# Altium project Hrafn.PrjPcb (part 1 of 3)
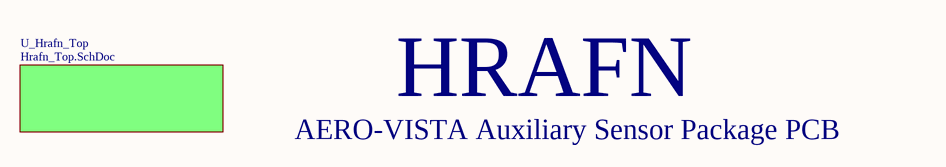
[diagram p0: Title.SchDoc]
Date: 6/18/2021; Drawn: Nicholas Belsten; ProgramName: AERO-VISTA; ProjectTitle: Hrafn; Revision: 1.4
10 sheets, 391 parts. Net scope: hierarchical (ports join the sheet entries above them; power ports are global).
Board file: Hrafn.PcbDoc
Sheets:
  Title.SchDoc
    U_Hrafn_Top = Hrafn_Top.SchDoc
      U_CAN_Bus = CAN_Bus.SchDoc
      U_Magnetometers = Magnetometers.SchDoc
        MF8 = Magnetometer_Filter.SchDoc
        MF7 = Magnetometer_Filter.SchDoc
        MF6 = Magnetometer_Filter.SchDoc
        MF5 = Magnetometer_Filter.SchDoc
        MF4 = Magnetometer_Filter.SchDoc
        MF3 = Magnetometer_Filter.SchDoc
        MF2 = Magnetometer_Filter.SchDoc
        MF1 = Magnetometer_Filter.SchDoc
        MC1 = Magnetometer_Channel.SchDoc
        MC2 = Magnetometer_Channel.SchDoc
      U_Power_HK = Power_HK.SchDoc
        LCF = LC_Filter.SchDoc
      U_Clock = Clock.SchDoc
      U_Ethernet = Ethernet.SchDoc

## Sheet Title.SchDoc: Hrafn
size Tabloid; Author: Nicholas Belsten; DrawnBy: Nicholas Belsten; Revision: 1.4; SheetNumber: 1; SheetTotal: 10; DCN: Aika; ProgramName: AERO-VISTA; Section: Title

### Sub-sheets
U_Hrafn_Top = Hrafn_Top.SchDoc: no entries

### Notes on the sheet
- HRAFN
- AERO-VISTA Auxiliary Sensor Package PCB
- Title
- Size
- Date
- Tabloid
- Section
- Time
- Sheet
- of
- Revision
- Drawn
- 33-207 / 77 Mass. Ave.
- Cambridge, MA 02139
- File

## Sheet Hrafn_Top.SchDoc: Hrafn
size Tabloid; DrawnBy: Nicholas Belsten; Organization: MIT; Address1: Route 40; Address2: Westford MA 01886; Address3: USA; DocumentNumber: 1; Revision: 1.4; SheetNumber: 2; SheetTotal: 10; DCN: Aika; ProgramName: AERO-VISTA; Section: Top
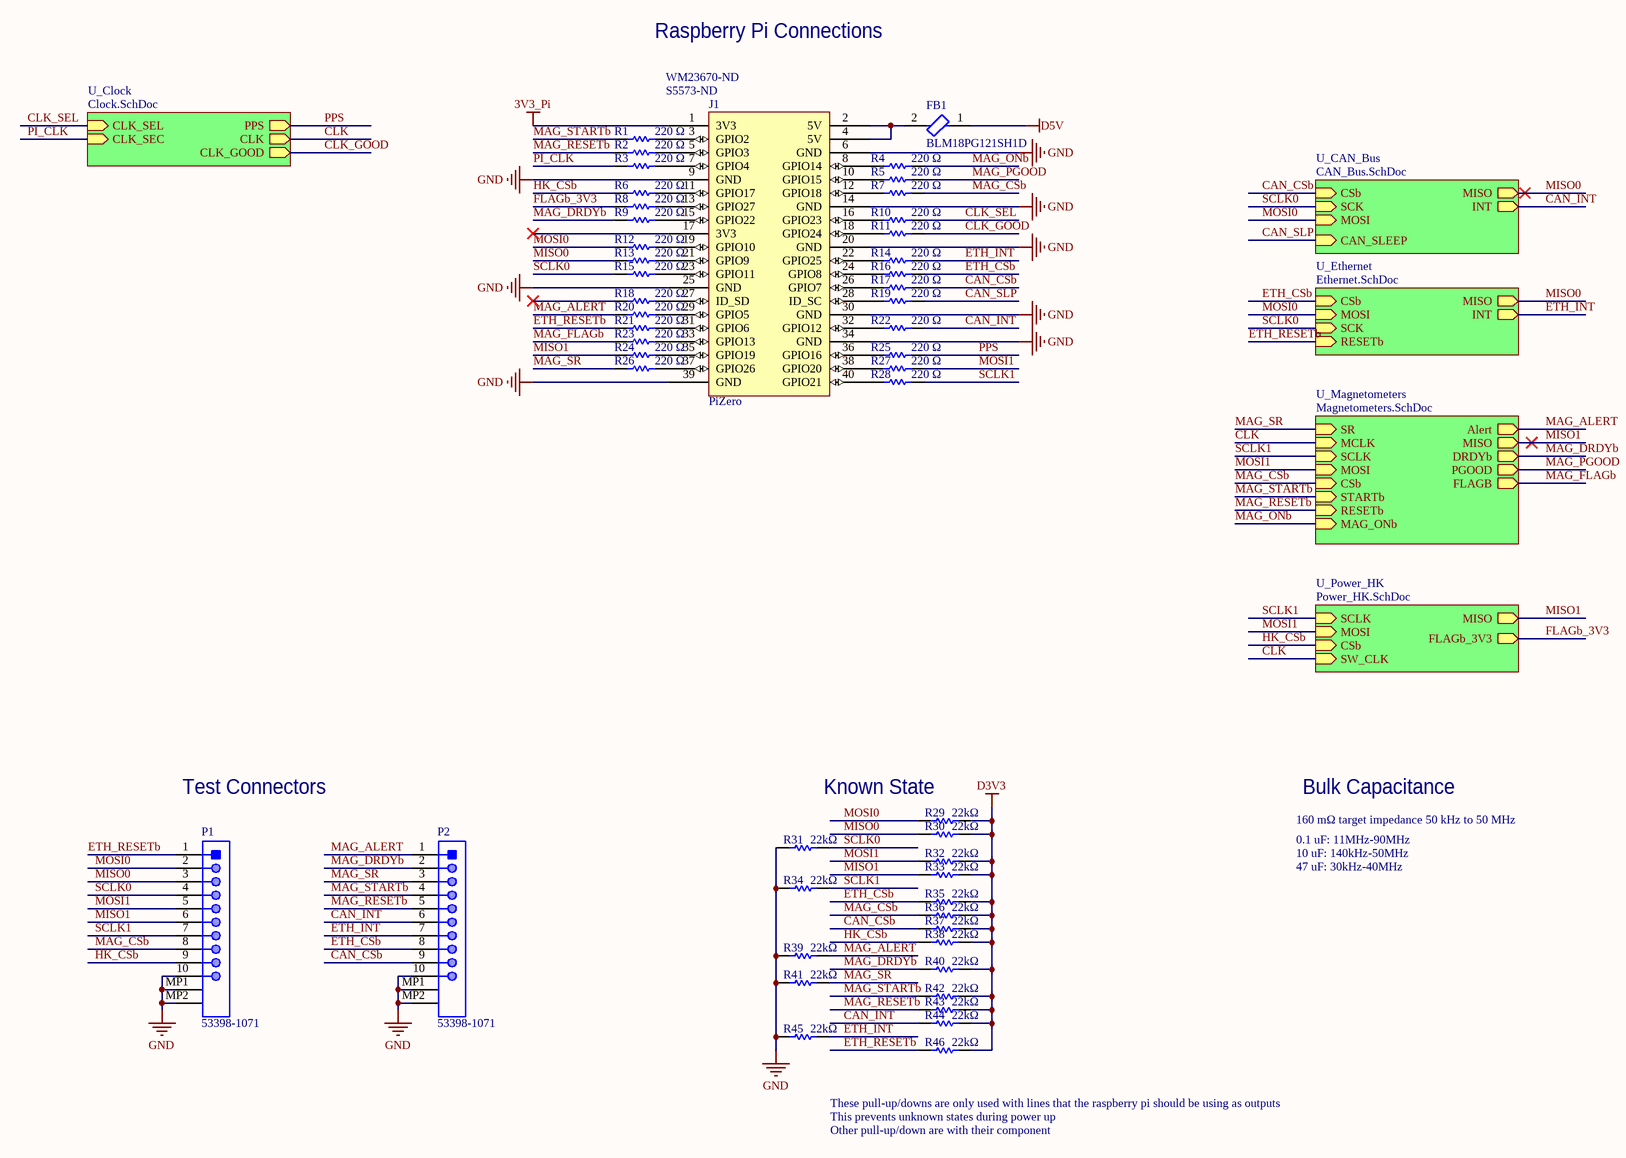
[diagram p1: Hrafn_Top.SchDoc]

### Parts
FB1  BLM18PG121SH1D  [FP-BLM18-0_15-t0_8-IPC_C]
J1  PiZero  Supplier Part Number 1: S5573-ND  Supplier Part Number 2: WM23670-ND  [DIP40]
P1  53398-1071  [MOLX-53398-1071_V]
P2  53398-1071  [MOLX-53398-1071_V]
R1  220 Ω  [RESC1005X40X25LL05T05]
R2  220 Ω  [RESC1005X40X25LL05T05]
R3  220 Ω  [RESC1005X40X25LL05T05]
R4  220 Ω  [RESC1005X40X25LL05T05]
R5  220 Ω  [RESC1005X40X25LL05T05]
R6  220 Ω  [RESC1005X40X25LL05T05]
R7  220 Ω  [RESC1005X40X25LL05T05]
R8  220 Ω  [RESC1005X40X25LL05T05]
R9  220 Ω  [RESC1005X40X25LL05T05]
R10  220 Ω  [RESC1005X40X25LL05T05]
R11  220 Ω  [RESC1005X40X25LL05T05]
R12  220 Ω  [RESC1005X40X25LL05T05]
R13  220 Ω  [RESC1005X40X25LL05T05]
R14  220 Ω  [RESC1005X40X25LL05T05]
R15  220 Ω  [RESC1005X40X25LL05T05]
R16  220 Ω  [RESC1005X40X25LL05T05]
R17  220 Ω  [RESC1005X40X25LL05T05]
R18  220 Ω  [RESC1005X40X25LL05T05]
R19  220 Ω  [RESC1005X40X25LL05T05]
R20  220 Ω  [RESC1005X40X25LL05T05]
R21  220 Ω  [RESC1005X40X25LL05T05]
R22  220 Ω  [RESC1005X40X25LL05T05]
R23  220 Ω  [RESC1005X40X25LL05T05]
R24  220 Ω  [RESC1005X40X25LL05T05]
R25  220 Ω  [RESC1005X40X25LL05T05]
R26  220 Ω  [RESC1005X40X25LL05T05]
R27  220 Ω  [RESC1005X40X25LL05T05]
R28  220 Ω  [RESC1005X40X25LL05T05]
R29  22kΩ  [RESC1005X40X25LL05T05]
R30  22kΩ  [RESC1005X40X25LL05T05]
R31  22kΩ  [RESC1005X40X25LL05T05]
R32  22kΩ  [RESC1005X40X25LL05T05]
R33  22kΩ  [RESC1005X40X25LL05T05]
R34  22kΩ  [RESC1005X40X25LL05T05]
R35  22kΩ  [RESC1005X40X25LL05T05]
R36  22kΩ  [RESC1005X40X25LL05T05]
R37  22kΩ  [RESC1005X40X25LL05T05]
R38  22kΩ  [RESC1005X40X25LL05T05]
R39  22kΩ  [RESC1005X40X25LL05T05]
R40  22kΩ  [RESC1005X40X25LL05T05]
R41  22kΩ  [RESC1005X40X25LL05T05]
R42  22kΩ  [RESC1005X40X25LL05T05]
R43  22kΩ  [RESC1005X40X25LL05T05]
R44  22kΩ  [RESC1005X40X25LL05T05]
R45  22kΩ  [RESC1005X40X25LL05T05]
R46  22kΩ  [RESC1005X40X25LL05T05]

### Sub-sheets
U_CAN_Bus = CAN_Bus.SchDoc: CSb (in), SCK (in), MOSI (in), MISO (out), INT (out), CAN_SLEEP (in)
U_Clock = Clock.SchDoc: PPS (out), CLK_SEL (in), CLK (out), CLK_SEC (in), CLK_GOOD (out)
U_Ethernet = Ethernet.SchDoc: CSb (in), MOSI (in), MISO (out), SCK (in), INT (out), RESETb (in)
U_Magnetometers = Magnetometers.SchDoc: SR (in), MCLK (in), Alert (out), SCLK (in), MOSI (in), MISO (out), CSb (in), DRDYb (out), STARTb (in), RESETb (in), MAG_ONb (in), PGOOD (out), FLAGB (out)
U_Power_HK = Power_HK.SchDoc: SCLK (in), MOSI (in), MISO (out), CSb (in), SW_CLK (in), FLAGb_3V3 (out)

### Nets
3V3_Pi: J1.1(3V3)
D3V3: R29.2 R30.2 R32.2 R33.2 R35.2 R36.2 R37.2 R38.2 R40.2 R42.2 R43.2 R44.2 R46.2
D5V: FB1.1
GND: J1.6(GND) J1.9(GND) J1.14(GND) J1.20(GND) J1.25(GND) J1.30(GND) J1.34(GND) J1.39(GND) P1.10 P1.MP1 P1.MP2 P2.10 P2.MP1 P2.MP2 R31.1 R34.1 R39.1 R41.1 R45.1  [project net DGND]
CAN_CSb: P2.9 R17.2 R37.1 ; sheet U_CAN_Bus/CSb
CAN_INT: P2.6 R22.2 R44.1 ; sheet U_CAN_Bus/INT
CAN_SLP: R19.2 ; sheet U_CAN_Bus/CAN_SLEEP
CLK: sheet U_Magnetometers/MCLK, sheet U_Power_HK/SW_CLK, sheet U_Clock/CLK
CLK_GOOD: R11.2 ; sheet U_Clock/CLK_GOOD
CLK_SEL: R10.2 ; sheet U_Clock/CLK_SEL
ETH_CSb: P2.8 R16.2 R35.1 ; sheet U_Ethernet/CSb
ETH_INT: P2.7 R14.2 R45.2 ; sheet U_Ethernet/INT
ETH_RESETb: P1.1 R21.1 R46.1 ; sheet U_Ethernet/RESETb
FLAGb_3V3: R8.1 ; sheet U_Power_HK/FLAGb_3V3
HK_CSb: P1.9 R6.1 R38.1 ; sheet U_Power_HK/CSb
MAG_ALERT: P2.1 R20.1 R39.2 ; sheet U_Magnetometers/Alert
MAG_CSb: P1.8 R7.2 R36.1 ; sheet U_Magnetometers/CSb
MAG_DRDYb: P2.2 R9.1 R40.1 ; sheet U_Magnetometers/DRDYb
MAG_FLAGb: R23.1 ; sheet U_Magnetometers/FLAGB  [project net FLAGB_MAG]
MAG_ONb: R4.2 ; sheet U_Magnetometers/MAG_ONb
MAG_PGOOD: R5.2 ; sheet U_Magnetometers/PGOOD
MAG_RESETb: P2.5 R2.1 R43.1 ; sheet U_Magnetometers/RESETb
MAG_SR: P2.3 R26.1 R41.2 ; sheet U_Magnetometers/SR
MAG_STARTb: P2.4 R1.1 R42.1 ; sheet U_Magnetometers/STARTb
MISO0: P1.3 R13.1 R30.1 ; sheet U_CAN_Bus/MISO, sheet U_Ethernet/MISO
MISO1: P1.6 R24.1 R33.1 ; sheet U_Magnetometers/MISO, sheet U_Power_HK/MISO
MOSI0: P1.2 R12.1 R29.1 ; sheet U_CAN_Bus/MOSI, sheet U_Ethernet/MOSI
MOSI1: P1.5 R27.2 R32.1 ; sheet U_Magnetometers/MOSI, sheet U_Power_HK/MOSI
PI_CLK: R3.1 ; sheet U_Clock/CLK_SEC  [project net CLK_SEC]
PPS: R25.2 ; sheet U_Clock/PPS
SCLK0: P1.4 R15.1 R31.2 ; sheet U_CAN_Bus/SCK, sheet U_Ethernet/SCK
SCLK1: P1.7 R28.2 R34.2 ; sheet U_Magnetometers/SCLK, sheet U_Power_HK/SCLK
NetFB1_2: FB1.2 J1.2(5V) J1.4(5V)
NetJ1_3: J1.3(GPIO2) R1.2
NetJ1_5: J1.5(GPIO3) R2.2
NetJ1_7: J1.7(GPIO4) R3.2
NetJ1_8: J1.8(GPIO14) R4.1
NetJ1_10: J1.10(GPIO15) R5.1
NetJ1_11: J1.11(GPIO17) R6.2
NetJ1_12: J1.12(GPIO18) R7.1
NetJ1_13: J1.13(GPIO27) R8.2
NetJ1_15: J1.15(GPIO22) R9.2
NetJ1_16: J1.16(GPIO23) R10.1
NetJ1_18: J1.18(GPIO24) R11.1
NetJ1_19: J1.19(GPIO10) R12.2
NetJ1_21: J1.21(GPIO9) R13.2
NetJ1_22: J1.22(GPIO25) R14.1
NetJ1_23: J1.23(GPIO11) R15.2
NetJ1_24: J1.24(GPIO8) R16.1
NetJ1_26: J1.26(GPIO7) R17.1
NetJ1_27: J1.27(ID_SD) R18.2
NetJ1_28: J1.28(ID_SC) R19.1
NetJ1_29: J1.29(GPIO5) R20.2
NetJ1_31: J1.31(GPIO6) R21.2
NetJ1_32: J1.32(GPIO12) R22.1
NetJ1_33: J1.33(GPIO13) R23.2
NetJ1_35: J1.35(GPIO19) R24.2
NetJ1_36: J1.36(GPIO16) R25.1
NetJ1_37: J1.37(GPIO26) R26.2
NetJ1_38: J1.38(GPIO20) R27.1
NetJ1_40: J1.40(GPIO21) R28.1

Not connected (* = marked no-connect by the designer): J1 17(3V3)*; R18 1*

### Notes on the sheet
- Raspberry Pi Connections
- Test Connectors
- Known State
- 160 mΩ target impedance 50 kHz to 50 MHz
- Bulk Capacitance
- 0.1 uF: 11MHz-90MHz
- 10 uF: 140kHz-50MHz
- 47 uF: 30kHz-40MHz
- These pull-up/downs are only used with lines that the raspberry pi should be using as outputs
- This prevents unknown states during power up
- Other pull-up/down are with their component
- Title
- Size
- Date
- Tabloid
- Section
- Time
- Sheet
- of
- Revision
- Drawn
- 33-207 / 77 Mass. Ave.
- Cambridge, MA 02139
- File

### Library data of the parts
FB1 = CMP-06046-000335-1: Chip Ferrite Bead, 0603, 120Ω @ 100MHz, 0.05Ω, 25%, 2A; Impedance: 120R; Shielding: Unshielded; Number of Lines: 1; DC Resistance (DCR): 50mR; Case/Package: 0603; Max Current Rating: 2A; Ratings: AEC-Q200; Case Code (Metric): 1608; Height: 0.8mm; Max DC Current: 2A; Contact Plating: Tin; Max Operating Temperature: 125°C; Width: 0.031inch; Number of Circuits: 1; Min Operating Temperature: -55°C; Mount: Surface Mount; Test Frequency: 100MHz; Tolerance: 25%; Packaging: Tape and Reel; Length: 1.6mm; Weight: 7.1E-05oz; Package Quantity: 4000; Case Code (Imperial): 0603; Termination: SMD/SMT; Material: Ferrite; Depth: 0.8mm; Lead Free: Lead Free; Current Rating: 2A
P1 P2 = CMP-2000-05635-1: Male Header, Pitch 1.25 mm, 1 x 10 Position, Height 4.7 mm, -40 to 85 degC, RoHS, Tape and Reel; Manufacturer: Molex; Mounting Angle: Vertical; Pitch: 1.25mm; Voltage Rating: 125V; Current Rating: 1A; Number of Rows: 1Row; Housing Material: Nylon; Mounting Technology: SurfaceMount; Mounting Style: SMD; Contact Material: PhosphorBronze; Product: Headers; Datasheet URL: http://www.molex.com/pdm_docs/sd/533981071_sd.pdf; Manufacturer URL: http://www.molex.com/; Datasheet Version: Rev. J, 09/2015; Factory Pack Quantity: 1000; Brand: Molex; Packaging: Reel; Product Category: Headers&WireHousings; Contact Gender: Pin(Male); Number of Positions: 10Position; RoHS: Details; Contact Plating: Tin; Package Description: Male Header, Pitch 1.25 mm, 1 x 10 Position, Height 4.7 mm; Series: 53398; Type: Shrouded; Package Reference: 53398-1071; Tradename: PicoBlade; Termination Style: SMD
R1-R28 = CMP-2002-08356-1: Part Number: CRCW040220K0FKED; Manufacturer: Vishay Dale; Resistance: 220 Ω
R29-R46 = CMP-2002-00489-1: Manufacturer: Panasonic; Part Number: ERJ-2GEJ223X; Resistance: 22kΩ
J1 = PiZero: Supplier 1: Digi-Key; Supplier 2: Digi-Key

## Sheet CAN_Bus.SchDoc: Hrafn
size Tabloid; DrawnBy: Nicholas Belsten; Organization: MIT; Address1: Route 40; Address2: Westford MA 01886; Address3: USA; DocumentNumber: 8; Revision: 1.4; SheetNumber: 10; SheetTotal: 10; DCN: Aika; ProgramName: AERO-VISTA; Section: CAN
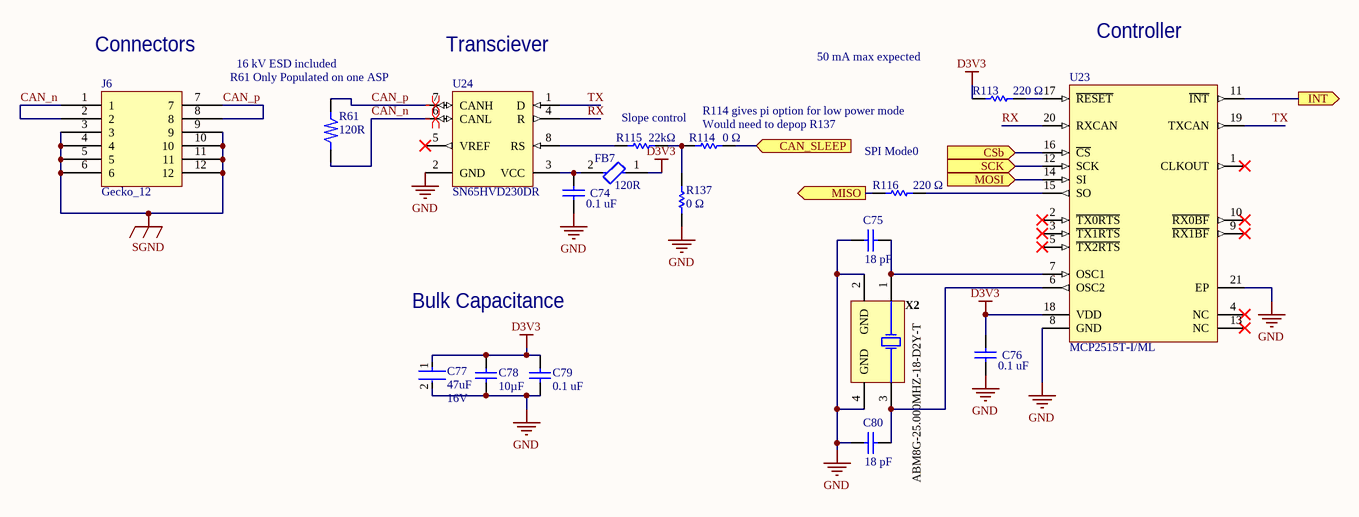
[diagram p2: CAN_Bus.SchDoc]

### Parts
C74  0.1 uF  [CAPC0402(1005)60_L]
C75  Capacitance: 18 pF  [CAPC1005X55X25LL05T10]  (hidden comment: GRM1555C1H180JA01D)
C76  0.1 uF  [CAPC0402(1005)60_L]
C77  Capacitance: 47uF  Voltage Rating: 16V  [FP-GRT32E-0_3-IPC_C]  (hidden comment: GRT32EC81C476ME13L)
C78  Capacitance: 10µF  [CAPC1608X100X35LL20T25]  (hidden comment: EMK107BBJ106MA-T)
C79  0.1 uF  [CAPC0402(1005)60_L]
C80  Capacitance: 18 pF  [CAPC1005X55X25LL05T10]  (hidden comment: GRM1555C1H180JA01D)
FB7  Impedance: 120R  [FP-BLM18-0_15-t0_8-IPC_C]  (hidden comment: BLM18PG121SH1D)
J6  Gecko_12  [GECK12]
R61  Resistance: 120R  [RESC1608X08L]  (hidden comment: R)
R113  220 Ω  [RESC1005X40X25LL05T05]
R114  Resistance: 0 Ω  [RESC1005X40X25LL05T05]  (hidden comment: ERJ2GE0R00X)
R115  22kΩ  [RESC1005X40X25LL05T05]
R116  220 Ω  [RESC1005X40X25LL05T05]
R137  Resistance: 0 Ω  [RESC1005X40X25LL05T05]  (hidden comment: ERJ2GE0R00X)
U23  MCP2515T-I/ML  [QFN-ML20_N]
U24  SN65HVD230DR  [D0008A_L]
X2  ABM8G-25.000MHZ-18-D2Y-T  [ABRA-ABM8G_V]

### Ports
CAN_SLEEP (in), CSb (in), INT (out), MISO (out), MOSI (in), SCK (in)

### Nets
D3V3: C76.2 C77.1 C78.2 C79.2 FB7.1 R113.1 U23.18(VDD)
GND: C74.1 C75.1 C76.1 C77.2 C78.1 C79.1 C80.1 R137.1 U23.8(GND) U23.21(EP) U24.2(GND) X2.2(GND) X2.4(GND)  [project net DGND]
SGND: J6.3 J6.4 J6.5 J6.6 J6.9 J6.10 J6.11 J6.12
CAN_CSb: U23.16(~{CS}) ; port CSb
CAN_INT: U23.11(~{INT}) ; port INT
CAN_n: J6.1 J6.2 R61.1 U24.6(CANL)
CAN_p: J6.7 J6.8 R61.0 U24.7(CANH)
CAN_SLP: R114.2 ; port CAN_SLEEP
MISO0: R116.1 ; port MISO
MOSI0: U23.14(SI) ; port MOSI
RX: U23.20(RXCAN) U24.4(R)
SCLK0: U23.12(SCK) ; port SCK
TX: U23.19(TXCAN) U24.1(D)
NetC74_2: C74.2 FB7.2 U24.3(VCC)
NetC75_2: C75.2 U23.7(OSC1) X2.1(X1)
NetC80_2: C80.2 U23.6(OSC2) X2.3(X2)
NetR113_2: R113.2 U23.17(~{RESET})
NetR114_1: R114.1 R115.2 R137.2
NetR115_1: R115.1 U24.8(RS)
NetR116_2: R116.2 U23.15(SO)

Not connected (* = marked no-connect by the designer): U23 1(CLKOUT)* 2(~{TX0RTS})* 3(~{TX1RTS})* 4(NC)* 5(~{TX2RTS})* 9(~{RX1BF})* 10(~{RX0BF})* 13(NC)*; U24 5(VREF)*

### Layout directives
differential pair: CAN_n, CAN_p

### Notes on the sheet
- Controller
- (near J6) Connectors
- (near R61) R61 Only Populated on one ASP
- 16 kV ESD included
- (near U24) Transciever
- Slope control
- (near R114) R114 gives pi option for low power mode
- 50 mA max expected
- (near R114) Would need to depop R137
- (near R116) SPI Mode0
- Bulk Capacitance
- Title
- Size
- Date
- Tabloid
- Section
- Time
- Sheet
- of
- Revision
- Drawn
- 33-207 / 77 Mass. Ave.
- Cambridge, MA 02139
- File

### Library data of the parts
C74 C76 C79 = CMP-1034-02068-1: CAP 100nF 16V ±5% 0402 (1005 Metric) Thickness 0.6mm SMD; Tolerance: Â±5%; Case-EIA: 0402; Case-Metric: 1005; Technology: SMT; Value: 100nF; Max Thickness: 0.6 mm; Rated Voltage: 16 V
C75 C80 = CMP-2008-03918-1: Manufacturer: Murata; Part Number: GRM1555C1H180JA01D
C77 = CMP-06035-034903-1: Multi-Layer Ceramic Capacitor 47uF 16V X6S ±20% 1210 Emboss T/R; Ratings: AEC-Q200; Thickness: 0.106inch; Max Operating Temperature: 105°C; Width: 0.098inch; Case/Package: 1210; Length: 0.126inch; Mount: Surface Mount; Min Operating Temperature: -55°C; Tolerance: 20%; Case Code (Imperial): 1210; Case Code (Metric): 3225; Packaging: Tape and Reel
C78 = CMP-2000-06226-1: Chip Capacitor, 10 uF, +/- 20%, 16 V, -55 to 85 degC, 0603 (1608 Metric), RoHS, Tape and Reel; Manufacturer: Taiyo Yuden; Voltage - Rated: 16V; Temperature Coefficient: X5R; Other Names: 587-3238-6; Online Catalog: MSeries; Features: -; Thickness (Max): 0.031"(0.80mm); Package / Case: 0603(1608Metric); Datasheet URL: http://www.yuden.co.jp/ut/product/category/capacitor/EMK107BBJ106MA-T.pdf; Category: Capacitors; Lead Style: -; Family: CeramicCapacitors; Package Description: 2-Pin Surface Mount Device, Body 1.70 x 0.90 mm; Tolerance: ±20%; Manufacturer URL: http://www.t-yuden.com/; Operating Temperature: -55°C~85°C; Lead Spacing: -; Height - Seated (Max): -; Series: M; Applications: GeneralPurpose; Size / Dimension: 0.063"Lx0.031"W(1.60mmx0.80mm); Standard Package: 1; Packaging: Digi-Reel®; Mounting Technology: SurfaceMount; Package Reference: 0603; Ratings: -; Datasheet Version: 10/2016; Mounting Type: SurfaceMount,MLCC
FB7 = CMP-06046-000335-1: Chip Ferrite Bead, 0603, 120Ω @ 100MHz, 0.05Ω, 25%, 2A; Shielding: Unshielded; Number of Lines: 1; DC Resistance (DCR): 50mR; Case/Package: 0603; Max Current Rating: 2A; Ratings: AEC-Q200; Case Code (Metric): 1608; Height: 0.8mm; Max DC Current: 2A; Contact Plating: Tin; Max Operating Temperature: 125°C; Width: 0.031inch; Number of Circuits: 1; Min Operating Temperature: -55°C; Mount: Surface Mount; Test Frequency: 100MHz; Tolerance: 25%; Packaging: Tape and Reel; Length: 1.6mm; Weight: 7.1E-05oz; Package Quantity: 4000; Case Code (Imperial): 0603; Termination: SMD/SMT; Material: Ferrite; Depth: 0.8mm; Lead Free: Lead Free; Current Rating: 2A
R61 = R: ROHM - ESR03EZPJ121 - RES, AEC-Q200, THICK FILM, 120R, 5%, 0603 ROHS COMPLIANT: YES; pin to pad: 0>2; Power Rating: 250mW; Temperature Coefficient: 200ppm/°C; Supplier 1: Digi-Key; Supplier Part Number 1: RHM120DCT-ND; Manufacturer 1: Rohm; Manufacturer Part Number 1: ESR03EZPJ121; RoHS: Yes; Category: Chip SMD Resistors; Stock 1: 21155; Pricing 1: 1=0.10000, 10=0.08200, 100=0.03160, 1000=0.01392, 2500=0.01202 (USD); Case/Package: 0603; Case Code (Metric): 1608; Case Code (Imperial): 0603; Size Code: 0603; Min Operating Temperature: -55°C; Max Operating Temperature: 155°C; Tolerance: 5%; Package Quantity: 1; Packaging: Tape and Reel; Resistor Type: Thick Film; Number of Terminations: 2; Max Power Dissipation: 250mW; Features: Automotive AEC-Q200; Series: ESR; Length: 0.063inch; Width: 0.031inch; Height: 0.022inch; Lead Free: Lead Free; RoHS Compliant: Yes; ComponentLink1URL: https://datasheet.ciiva.com/2495/esr-2495284.pdf?src-supplier=Digi-Key; ComponentLink1Description: https://datasheet.ciiva.com/2495/esr-2495284.pdf?src-supplier=Digi-Key; ComponentLink2URL: https://datasheet.ciiva.com/2495/esr-2495285.pdf?src-supplier=Digi-Key; ComponentLink2Description: https://datasheet.ciiva.com/2495/esr-2495285.pdf?src-supplier=Digi-Key; ComponentLink3URL: https://datasheet.ciiva.com/2495/esr-2495286.pdf?src-supplier=Digi-Key; ComponentLink3Description: https://datasheet.ciiva.com/2495/esr-2495286.pdf?src-supplier=Digi-Key
R113 R116 = CMP-2002-08356-1: as R1 on sheet Hrafn_Top; Resistance: 220 Ω
R114 R137 = CMP-2000-07451-1: Chip Resistor, 0 Ohm, 0.1 W, -55 to 155 degC, 0402 (1005 Metric), RoHS, Tape and Reel; Manufacturer: Panasonic; Voltage Rating (DC): 50V; Temperature Coefficient: 600ppm/��C; Max Power Dissipation: 100mW; Tolerance: 5%; Number of Terminations: 2; Mount: SurfaceMount; Height: 0.35mm; Packaging: TapeandReel; Contact Plating: Tin; Manufacturer URL: http://www.panasonic.com/; Composition: ThickFilm; Max Operating Temperature: 155degC; REACH SVHC: NoSVHC; Case/Package: 0402; Package Reference: 402; Depth: 0.5mm; Package Description: 2-Pin Surface Mount Device, Body 1 x 0.5 mm; Datasheet URL: https://industrial.panasonic.com/cdbs/www-data/pdf/RDA0000/AOA0000C301.pdf; RoHSCompliant: True; Case Code (Imperial): 0402; Military Standard: Not; Min Operating Temperature: -55degC; Power Rating: 100mW; Datasheet Version: 03/2015; Length: 1mm; Case Code (Metric): 1005; Termination: SMD/SMT; Mounting Technology: SurfaceMount; Voltage Rating: 50V; Width: 0.02inch; Package Quantity: 1; Lead Free: LeadFree; Radiation Hardening: No
R115 = CMP-2002-00489-1: as R29 on sheet Hrafn_Top; Resistance: 22kΩ
U23 = CMP-0186-00186-1: Stand-Alone CAN Controller With SPI Interface, 20-Pin QFN, Industrial Temperature, Tape and Reel; ComponentLink3URL: http://www.microchip.com/stellent/groups/techpub_sg/documents/packagingspec/en012702.pdf; ComponentLink1Description: Manufacturer URL; ComponentLink3Description: Package Specification; ComponentLink2URL: http://ww1.microchip.com/downloads/en/DeviceDoc/21801F.pdf; DatasheetVersion: revF, Oct-2010; ComponentLink1URL: http://www.microchip.com/; PackageDescription: 20-Lead Plastic Quad Flat, No Lead Package (ML) - 4x4x0.9 mm Body [QFN]; ComponentLink2Description: Datasheet; PackageReference: QFN-ML20; PackageVersion: revBB, Aug-2009
U24 = CMP-0315-00015-2: 3.3V CAN Transceiver with Standby Mode, 17 mA, -40 to 85 degC, 8-pin SOIC (D), Green (RoHS & no Sb/Br); Manufacturer: Texas Instruments; Rating: Catalog; Transient Pulse Protection(V): -25 to 25; Receivers Per Package: 1; ICC(Max)(mA): 17; Supply Voltage(s)(V): 3.3; Low Power Mode: Standby; Mounting Technology: Surface Mount; PackageReference: D0008A; Footprint: PCA82C250; ComponentLink1URL: http://www.ti.com/general/docs/lit/getliterature.tsp?genericPartNumber=SN65HVD230&fileType=pdf; Code_JEDEC: MS-012AA; ComponentLink1Description: Datasheet; Eco-Plan: Green (RoHS & no Sb/Br); PartNumber: SN65HVD230DR; PackageDescription: 8-Pin Plastic Small Outline Integrated Circuit, 4.9 x 3.9 mm, Pitch 1.27 mm Pitch; Isolated: No; DatasheetVersion: SLOS346K; PackageVersion: revM, Jun-2011; SubFamily: CAN; Drivers Per Package: 1
X2 = CMP-2000-05733-1: Ultra Miniature Ceramic Glass Sealed SMD Crystal, 25 MHz, -40 to 85 degC, 4-Pin SMD, RoHS, Tape and Reel; Manufacturer: ABRACON; Frequency: 25MHz; Case Length: 3.2mm; Case Width: 2.5mm; ESR: 60Ohms; Frequency Stability: 30PPM; Tolerance: 20PPM; Case Height: 1mm; Load Capacitance: 18pF; Package Description: 4-Pin Surface Mount Device, Body 2.5 x 3.2 mm, Pitch 2.2 mm; Manufacturer URL: http://www.abracon.com/; Mounting Technology: SurfaceMount; Datasheet Version: 08/2015; Dimensions: 2.5mmWx3.2mmLx1mmH; Operating Temperature Range: -40Cto+85C; Packaging: Reel; RoHS: Details; Product Category: Crystals; Package Reference: ABM8G; Package / Case: 3.2mmx2.5mm; Brand: ABRACON; Datasheet URL: http://www.abracon.com/Resonators/ABM8G.pdf; Termination Style: SMD/SMT; Type: UltraMiniatureGlassSealedCrystal; Mounting Style: SMD/SMT; Series: ABM8G; Factory Pack Quantity: 1000

## Sheet Magnetometers.SchDoc: Hrafn
size Tabloid; DrawnBy: Nicholas Belsten; Organization: MIT; Address1: Route 40; Address2: Westford MA 01886; Address3: USA; DocumentNumber: 2; Revision: 1.4; SheetNumber: 3; SheetTotal: 10; DCN: Aika; ProgramName: AERO-VISTA; Section: Magnetometers
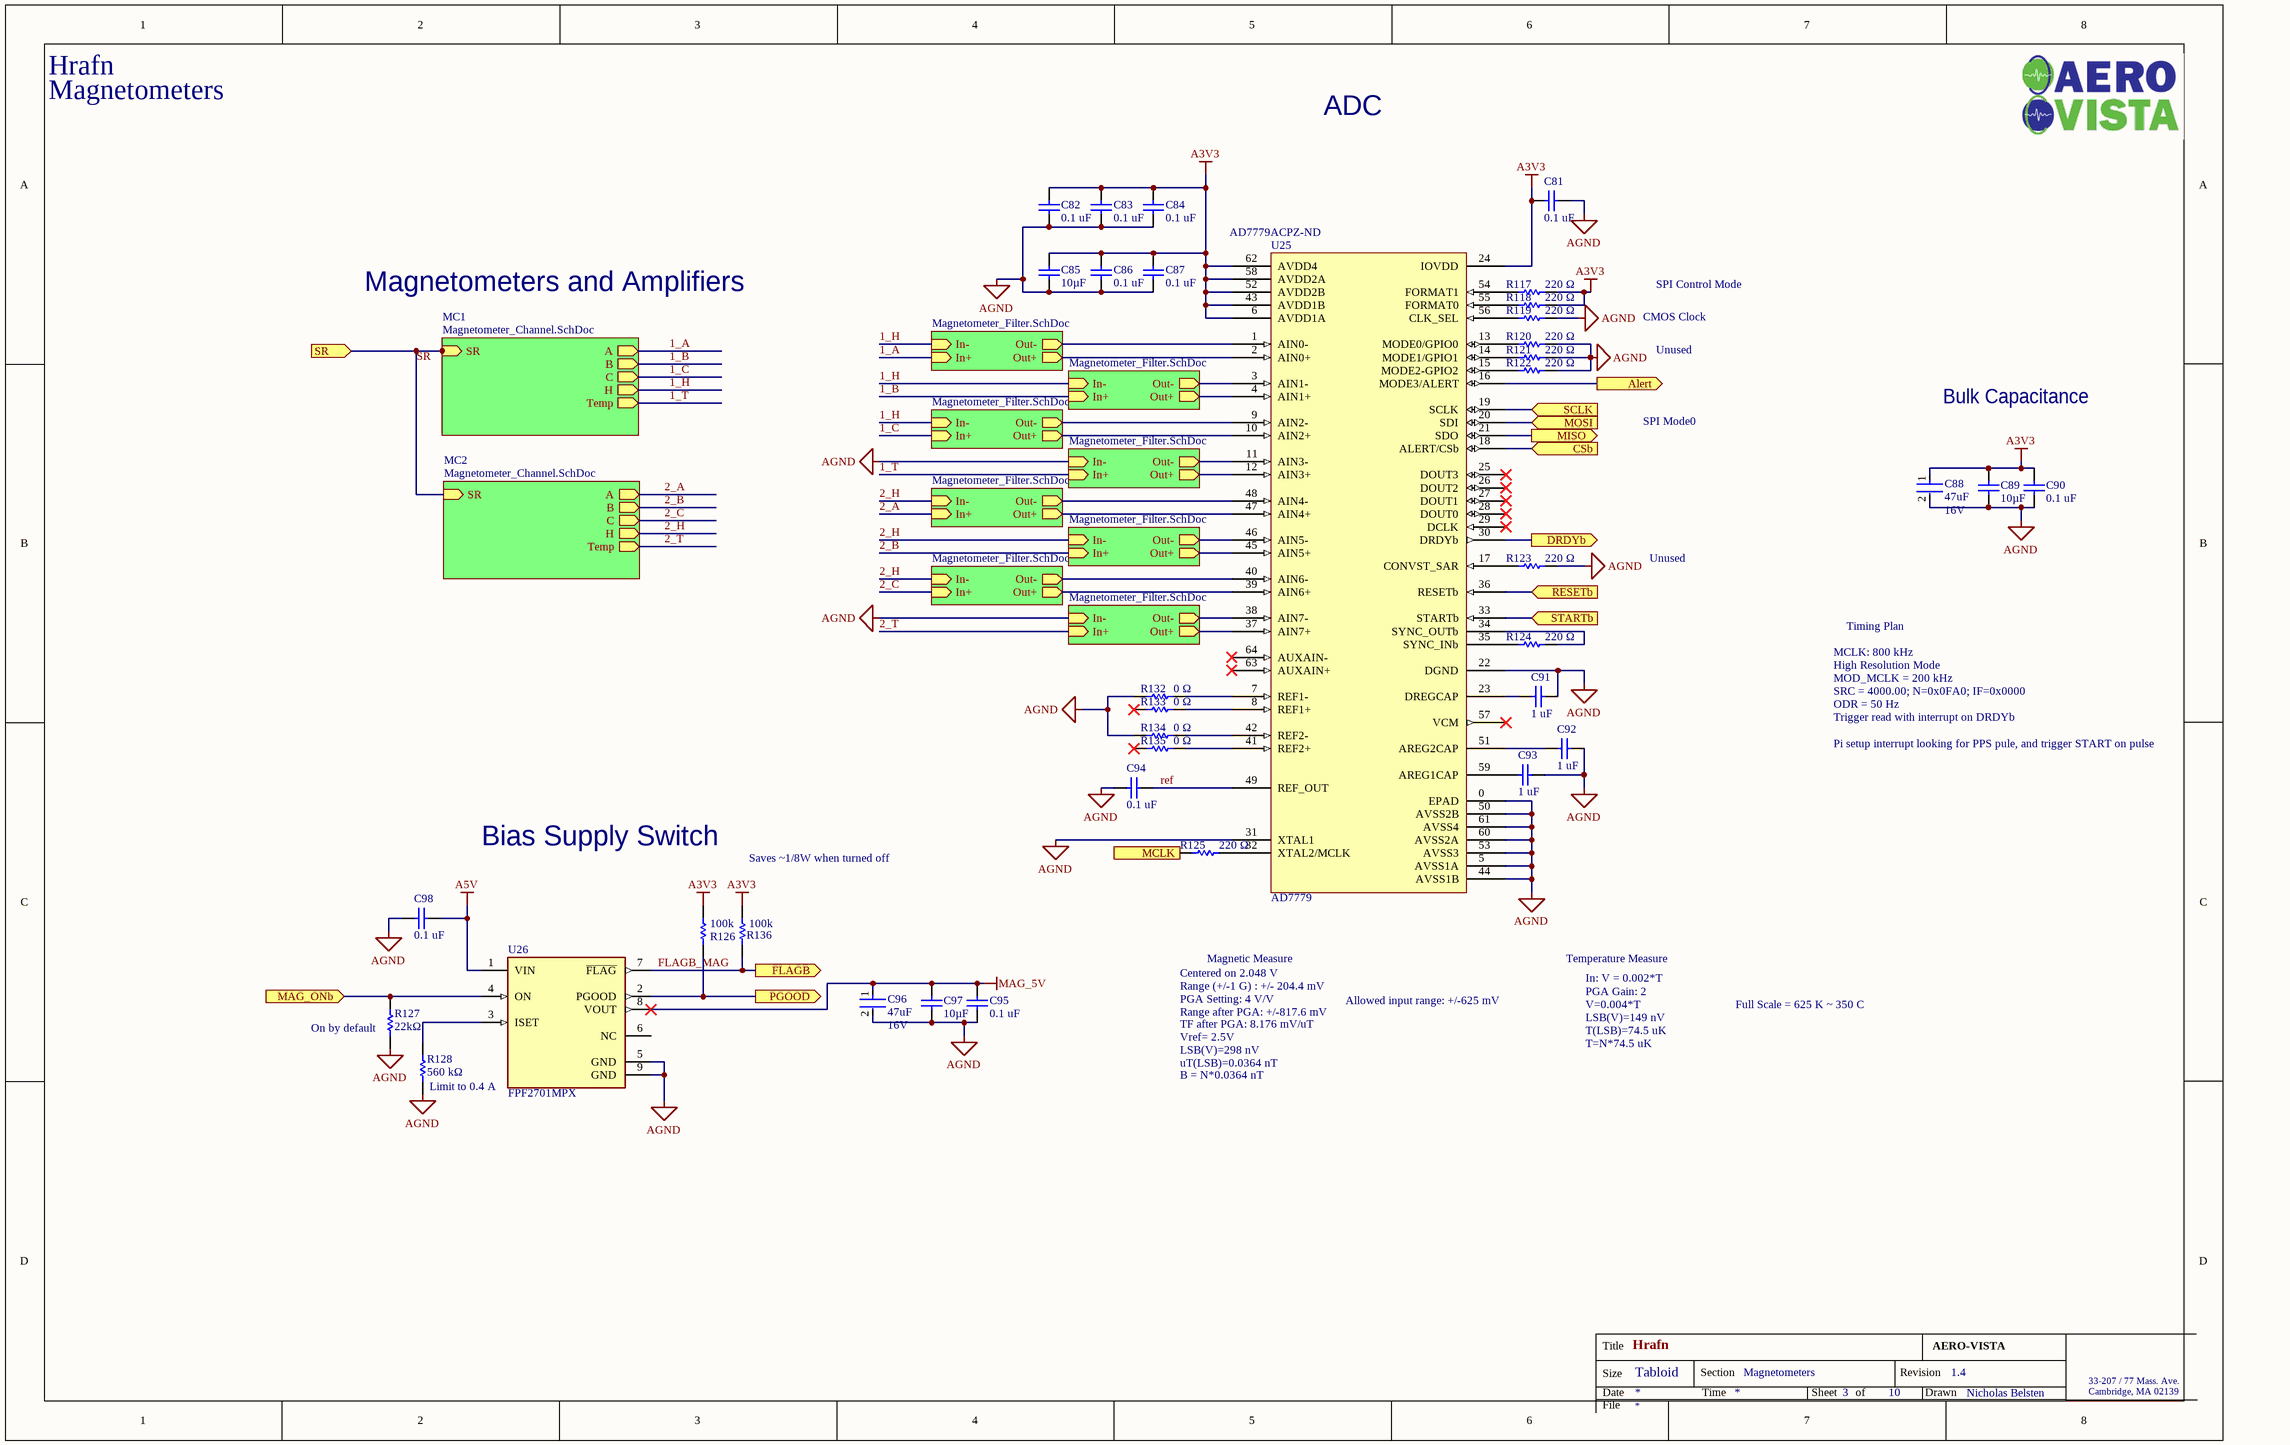
[diagram p3: Magnetometers.SchDoc]

### Parts
C81  0.1 uF  [CAPC0402(1005)60_L]
C82  0.1 uF  [CAPC0402(1005)60_L]
C83  0.1 uF  [CAPC0402(1005)60_L]
C84  0.1 uF  [CAPC0402(1005)60_L]
C85  Capacitance: 10µF  [CAPC1608X100X35LL20T25]  (hidden comment: EMK107BBJ106MA-T)
C86  0.1 uF  [CAPC0402(1005)60_L]
C87  0.1 uF  [CAPC0402(1005)60_L]
C88  Capacitance: 47uF  Voltage Rating: 16V  [FP-GRT32E-0_3-IPC_C]  (hidden comment: GRT32EC81C476ME13L)
C89  Capacitance: 10µF  [CAPC1608X100X35LL20T25]  (hidden comment: EMK107BBJ106MA-T)
C90  0.1 uF  [CAPC0402(1005)60_L]
C91  1 uF  [CAPC1005X60X30NL05T10]
C92  1 uF  [CAPC1005X60X30NL05T10]
C93  1 uF  [CAPC1005X60X30NL05T10]
C94  0.1 uF  [CAPC0402(1005)60_L]
C95  0.1 uF  [CAPC0402(1005)60_L]
C96  Capacitance: 47uF  Voltage Rating: 16V  [FP-GRT32E-0_3-IPC_C]  (hidden comment: GRT32EC81C476ME13L)
C97  Capacitance: 10µF  [CAPC1608X100X35LL20T25]  (hidden comment: EMK107BBJ106MA-T)
C98  0.1 uF  [CAPC0402(1005)60_L]
R117  220 Ω  [RESC1005X40X25LL05T05]
R118  220 Ω  [RESC1005X40X25LL05T05]
R119  220 Ω  [RESC1005X40X25LL05T05]
R120  220 Ω  [RESC1005X40X25LL05T05]
R121  220 Ω  [RESC1005X40X25LL05T05]
R122  220 Ω  [RESC1005X40X25LL05T05]
R123  220 Ω  [RESC1005X40X25NL05T05]
R124  220 Ω  [RESC1005X40X25NL05T05]
R125  220 Ω  [RESC1005X40X25LL05T05]
R126  Resistance: 100k  [RESC1005X40X25LL05T05]  (hidden comment: CRCW0402100KJNED)
R127  22kΩ  [RESC1005X40X25LL05T05]
R128  Resistance: 560 kΩ  [RESC1005X40X25LL05T05]  (hidden comment: ERJ2RKF5603X)
R132  Resistance: 0 Ω  [RESC1005X40X25LL05T05]  (hidden comment: ERJ2GE0R00X)
R133  Resistance: 0 Ω  [RESC1005X40X25LL05T05]  (hidden comment: ERJ2GE0R00X)
R134  Resistance: 0 Ω  [RESC1005X40X25LL05T05]  (hidden comment: ERJ2GE0R00X)
R135  Resistance: 0 Ω  [RESC1005X40X25LL05T05]  (hidden comment: ERJ2GE0R00X)
R136  Resistance: 100k  [RESC1005X40X25LL05T05]  (hidden comment: CRCW0402100KJNED)
U25  AD7779  Supplier Part Number 1: AD7779ACPZ-ND  [AD7779]
U26  FPF2701MPX  [FP-511DD-MFG]

### Sub-sheets
MC1 = Magnetometer_Channel.SchDoc: SR (in), A (out), B (out), C (out), H (out), Temp (out)
MC2 = Magnetometer_Channel.SchDoc: SR (in), A (out), B (out), C (out), H (out), Temp (out)
MF1 = Magnetometer_Filter.SchDoc: In+ (in), Out+ (out), In- (in), Out- (out)
MF2 = Magnetometer_Filter.SchDoc: In+ (in), Out+ (out), In- (in), Out- (out)
MF3 = Magnetometer_Filter.SchDoc: In+ (in), Out+ (out), In- (in), Out- (out)
MF4 = Magnetometer_Filter.SchDoc: In+ (in), Out+ (out), In- (in), Out- (out)
MF5 = Magnetometer_Filter.SchDoc: In+ (in), Out+ (out), In- (in), Out- (out)
MF6 = Magnetometer_Filter.SchDoc: In+ (in), Out+ (out), In- (in), Out- (out)
MF7 = Magnetometer_Filter.SchDoc: In+ (in), Out+ (out), In- (in), Out- (out)
MF8 = Magnetometer_Filter.SchDoc: In+ (in), Out+ (out), In- (in), Out- (out)

### Ports
Alert (out), CSb (in), DRDYb (out), FLAGB (out), MAG_ONb (in), MCLK (in), MISO (out), MOSI (in), PGOOD (out), RESETb (in), SCLK (in), SR (in), STARTb (in)

### Nets
A3V3: C81.2 C82.2 C83.2 C84.2 C85.2 C86.2 C87.2 C88.1 C89.2 C90.2 R117.2 R118.2 R126.2 R136.2 U25.6(AVDD1A) U25.24(IOVDD) U25.43(AVDD1B) U25.52(AVDD2B) U25.58(AVDD2A) U25.62(AVDD4)
A5V: C98.2 U26.1(VIN)
AGND: C81.1 C82.1 C83.1 C84.1 C85.1 C86.1 C87.1 C88.2 C89.1 C90.1 C91.1 C92.1 C93.1 C94.1 C95.1 C96.2 C97.1 C98.1 R119.2 R120.2 R121.2 R122.2 R123.2 R127.1 R128.1 R132.1 R134.1 U25.0(EPAD) U25.5(AVSS1A) U25.22(DGND) U25.31(XTAL1) U25.44(AVSS1B) U25.50(AVSS2B) U25.53(AVSS3) U25.60(AVSS2A) U25.61(AVSS4) U26.5(GND) U26.9(GND) ; sheet MF8/In-, sheet MF4/In-
MAG_5V: C95.2 C96.1 C97.2 U26.8(VOUT)
1_A: sheet MF1/In+, sheet MC1/A
1_B: sheet MF2/In+, sheet MC1/B
1_C: sheet MF3/In+, sheet MC1/C
1_H: sheet MF3/In-, sheet MF2/In-, sheet MF1/In-, sheet MC1/H
1_T: sheet MF4/In+, sheet MC1/Temp
2_A: sheet MF5/In+, sheet MC2/A
2_B: sheet MF6/In+, sheet MC2/B
2_C: sheet MF7/In+, sheet MC2/C
2_H: sheet MF7/In-, sheet MF6/In-, sheet MF5/In-, sheet MC2/H
2_T: sheet MF8/In+, sheet MC2/Temp
CLK: R125.1 ; port MCLK
FLAGB_MAG: R136.1 U26.7(~{FLAG}) ; port FLAGB
MAG_ALERT: U25.16(MODE3/ALERT) ; port Alert
MAG_CSb: U25.18(ALERT/CSb) ; port CSb
MAG_DRDYb: U25.30(DRDYb) ; port DRDYb
MAG_ONb: R127.2 U26.4(ON) ; port MAG_ONb
MAG_PGOOD: R126.1 U26.2(PGOOD) ; port PGOOD
MAG_RESETb: U25.36(RESETb) ; port RESETb
MAG_STARTb: U25.33(STARTb) ; port STARTb
MISO1: U25.21(SDO) ; port MISO
MOSI1: U25.20(SDI) ; port MOSI
ref: C94.2 U25.49(REF_OUT)
SCLK1: U25.19(SCLK) ; port SCLK
SR: port SR, sheet MC1/SR, sheet MC2/SR  [project net MAG_SR]
NetC91_2: C91.2 U25.23(DREGCAP)
NetC92_2: C92.2 U25.51(AREG2CAP)
NetC93_2: C93.2 U25.59(AREG1CAP)
NetC99A_1: U25.38(AIN7-) ; sheet MF8/Out-
NetC99A_2: U25.37(AIN7+) ; sheet MF8/Out+
NetC99B_1: U25.40(AIN6-) ; sheet MF7/Out-
NetC99B_2: U25.39(AIN6+) ; sheet MF7/Out+
NetC99C_1: U25.46(AIN5-) ; sheet MF6/Out-
NetC99C_2: U25.45(AIN5+) ; sheet MF6/Out+
NetC99D_1: U25.48(AIN4-) ; sheet MF5/Out-
NetC99D_2: U25.47(AIN4+) ; sheet MF5/Out+
NetC99E_1: U25.11(AIN3-) ; sheet MF4/Out-
NetC99E_2: U25.12(AIN3+) ; sheet MF4/Out+
NetC99F_1: U25.9(AIN2-) ; sheet MF3/Out-
NetC99F_2: U25.10(AIN2+) ; sheet MF3/Out+
NetC99G_1: U25.3(AIN1-) ; sheet MF2/Out-
NetC99G_2: U25.4(AIN1+) ; sheet MF2/Out+
NetC99H_1: U25.1(AIN0-) ; sheet MF1/Out-
NetC99H_2: U25.2(AIN0+) ; sheet MF1/Out+
NetR117_1: R117.1 U25.54(FORMAT1)
NetR118_1: R118.1 U25.55(FORMAT0)
NetR119_1: R119.1 U25.56(CLK_SEL)
NetR120_1: R120.1 U25.13(MODE0/GPIO0)
NetR121_1: R121.1 U25.14(MODE1/GPIO1)
NetR122_1: R122.1 U25.15(MODE2-GPIO2)
NetR123_1: R123.1 U25.17(CONVST_SAR)
NetR124_1: R124.1 U25.35(SYNC_INb)
NetR124_2: R124.2 U25.34(SYNC_OUTb)
NetR125_2: R125.2 U25.32(XTAL2/MCLK)
NetR128_2: R128.2 U26.3(ISET)
NetR132_2: R132.2 U25.7(REF1-)
NetR133_2: R133.2 U25.8(REF1+)
NetR134_2: R134.2 U25.42(REF2-)
NetR135_2: R135.2 U25.41(REF2+)

Not connected (* = marked no-connect by the designer): R133 1*; R135 1*; U25 25(DOUT3)* 26(DOUT2)* 27(DOUT1)* 28(DOUT0)* 29(DCLK)* 57(VCM)* 63(AUXAIN+)* 64(AUXAIN-)*; U26 6(NC)

### Notes on the sheet
- ADC
- Magnetometers and Amplifiers
- SPI Control Mode
- CMOS Clock
- Unused
- SPI Mode0
- Bulk Capacitance
- MCLK: 800 kHz
- High Resolution Mode
- MOD_MCLK = 200 kHz
- Timing Plan
- SRC = 4000.00; N=0x0FA0; IF=0x0000
- ODR = 50 Hz
- Trigger read with interrupt on DRDYb
- Pi setup interrupt looking for PPS pule, and trigger START on pulse
- Bias Supply Switch
- Saves ~1/8W when turned off
- Range (+/-1 G) : +/- 204.4 mV
- PGA Setting: 4 V/V
- Centered on 2.048 V
- Magnetic Measure
- Allowed input range: +/-625 mV
- Temperature Measure
- In: V = 0.002*T
- PGA Gain: 2
- V=0.004*T
- Full Scale = 625 K ~ 350 C
- (near R127) On by default
- Range after PGA: +/-817.6 mV
- TF after PGA: 8.176 mV/uT
- Vref= 2.5V
- LSB(V)=298 nV
- uT(LSB)=0.0364 nT
- LSB(V)=149 nV
- T(LSB)=74.5 uK
- T=N*74.5 uK
- Limit to 0.4 A
- B = N*0.0364 nT
- Title
- Size
- Date
- Tabloid
- Section
- Time
- Sheet
- of
- Revision
- Drawn
- 33-207 / 77 Mass. Ave.
- Cambridge, MA 02139
- File

### Library data of the parts
C81-C84 C86 C87 C90 C94 C95 C98 = CMP-1034-02068-1: as C74 on sheet CAN_Bus; Technology: SMT; Value: 100nF; Max Thickness: 0.6 mm; Rated Voltage: 16 V
C85 C89 C97 = CMP-2000-06226-1: as C78 on sheet CAN_Bus; Features: -; Thickness (Max): 0.031"(0.80mm); Package / Case: 0603(1608Metric); Datasheet URL: http://www.yuden.co.jp/ut/product/category/capacitor/EMK107BBJ106MA-T.pdf; Category: Capacitors; Lead Style: -; Family: CeramicCapacitors; Package Description: 2-Pin Surface Mount Device, Body 1.70 x 0.90 mm; Tolerance: ±20%; Manufacturer URL: http://www.t-yuden.com/; Operating Temperature: -55°C~85°C; Lead Spacing: -; Height - Seated (Max): -; Series: M; Applications: GeneralPurpose; Size / Dimension: 0.063"Lx0.031"W(1.60mmx0.80mm); Standard Package: 1; Packaging: Digi-Reel®; Mounting Technology: SurfaceMount; Package Reference: 0603; Ratings: -; Datasheet Version: 10/2016; Mounting Type: SurfaceMount,MLCC
C88 C96 = CMP-06035-034903-1: as C77 on sheet CAN_Bus; Ratings: AEC-Q200; Thickness: 0.106inch; Max Operating Temperature: 105°C; Width: 0.098inch; Case/Package: 1210; Length: 0.126inch; Mount: Surface Mount; Min Operating Temperature: -55°C; Tolerance: 20%; Case Code (Imperial): 1210; Case Code (Metric): 3225; Packaging: Tape and Reel
C91-C93 = CMP-2008-02056-1: Part Number: C0402C105M8PACTU; Manufacturer: Kemet; Capacitance: 1 uF
R117-R125 = CMP-2002-08356-1: as R1 on sheet Hrafn_Top; Resistance: 220 Ω
R126 R136 = CMP-2002-08125-1: Manufacturer: Vishay Dale; Part Number: CRCW0402100KJNED
R127 = CMP-2002-00489-1: as R29 on sheet Hrafn_Top; Resistance: 22kΩ
R128 = CMP-2002-01162-1: Manufacturer: Panasonic; Part Number: ERJ2RKF5603X
R132-R135 = CMP-2000-07451-1: as R114 on sheet CAN_Bus; Number of Terminations: 2; Mount: SurfaceMount; Height: 0.35mm; Packaging: TapeandReel; Contact Plating: Tin; Manufacturer URL: http://www.panasonic.com/; Composition: ThickFilm; Max Operating Temperature: 155degC; REACH SVHC: NoSVHC; Case/Package: 0402; Package Reference: 402; Depth: 0.5mm; Package Description: 2-Pin Surface Mount Device, Body 1 x 0.5 mm; Datasheet URL: https://industrial.panasonic.com/cdbs/www-data/pdf/RDA0000/AOA0000C301.pdf; RoHSCompliant: True; Case Code (Imperial): 0402; Military Standard: Not; Min Operating Temperature: -55degC; Power Rating: 100mW; Datasheet Version: 03/2015; Length: 1mm; Case Code (Metric): 1005; Termination: SMD/SMT; Mounting Technology: SurfaceMount; Voltage Rating: 50V; Width: 0.02inch; Package Quantity: 1; Lead Free: LeadFree; Radiation Hardening: No
U25 = AD7779: ANALOG DEVICES - AD7779ACPZ - Analogue to Digital Converter, 8-CH, Sigma-Delta, 24 bit, 16 kSPS, Differential, Single Ended, SPI; Number of Bits: 24; Sampling Rate: 16000S/s; Interface: Serial,SPI; Number of A/D Converters: 8; Min Supply Voltage: 2.2V; Max Supply Voltage: 3.6V; Resolution: 24b; Supplier 1: Digi-Key; Manufacturer 1: Analog Devices; Manufacturer Part Number 1: AD7779ACPZ; RoHS: Yes; Category: Analog to Digital Converters (ADCs); Stock 1: 259; Pricing 1: 1=13.27000, 10=12.19800, 25=11.69200, 100=9.79600, 250=9.16400, 500=8.53200, 1000=8.40560 (USD); Number of Pins: 64; Min Operating Temperature: -40°C; Max Operating Temperature: 125°C; Packaging: Tray; Number of Inputs: 8; Lead Free: Contains Lead; REACH SVHC: No SVHC; ComponentLink1URL: http://www.mouser.com/ds/2/609/AD7779-907534.pdf?src-supplier=Mouser; ComponentLink1Description: http://www.mouser.com/ds/2/609/AD7779-907534.pdf?src-supplier=Mouser; ComponentLink2URL: http://www.farnell.com/datasheets/2251075.pdf?src-supplier=Farnell; ComponentLink2Description: http://www.farnell.com/datasheets/2251075.pdf?src-supplier=Farnell; ComponentLink3URL: http://www.farnell.com/datasheets/2170257.pdf?src-supplier=Element14; ComponentLink3Description: http://www.farnell.com/datasheets/2170257.pdf?src-supplier=Element14; ComponentLink4URL: http://www.analog.com/media/en/technical-documentation/data-sheets/AD7779.pdf?src-supplier=Digi-Key; ComponentLink4Description: http://www.analog.com/media/en/technical-documentation/data-sheets/AD7779.pdf?src-supplier=Digi-Key
U26 = CMP-07123-000004-1: IC LOAD SWITCH 0.4-2A OCP 8MLP; Manufacturer: ON Semiconductor; Turn On Delay Time: 2.7ms; Max Junction Temp: +125°C; Turn Off Delay Time: 0.1ms; Nominal Supply Current: 92uA; Number Of Outputs: 1; Max Power Dissipation: 1.25W; Rise Time: 7.5ms; Min Supply Voltage: 2.8V; Standoff Height: 0mm; Max Supply Voltage: 36V; Fall Time: 1.5ms; Device Class L3: Gate Drivers; ComponentLink2URL: https://www.onsemi.com/pub/Collateral/FPF2702-D.pdf; Temperature Range High: +125°C; Manufacturer Part Number: FPF2701MPX; Category: IC; Automotive: No; Device Class L2: Power Management ICs; Octopart: https://octopart.com/fpf2701mpx-on+semiconductor-84327806; Package: 511DD; Ambient Temperature Range Low: -40°C; Temperature: -40°C to +125°C; Height: 0.8mm; Digikey Description: IC LOAD SWITCH 0.4-2A OCP 8MLP; Device Class L1: Integrated Circuits (ICs); ComponentLink2Description: Datasheet; Mouser Description: Power Switch ICs - Power Distribution AccuPower Advanced Load Mngmnt Products; Temperature Range Low: -40°C; Ipc Land Pattern Name: DFN300X300X80-8; RoHS: TRUE; Ambient Temperature Range High: +85°C; Output Current: 0.4-2A; Lead Free: Yes; Footprint Url: https://www.onsemi.com/pub/Collateral/511DD.PDF

## Sheet Magnetometer_Filter.SchDoc: Hrafn
size Tabloid; DrawnBy: Nicholas Belsten; Organization: MIT; Address1: Route 40; Address2: Westford MA 01886; Address3: USA; DocumentNumber: 4; Revision: 1.4; SheetNumber: 5; SheetTotal: 10; DCN: Aika; ProgramName: AERO-VISTA; Section: Magnetometer Filter
Used 8 times, as channels U_Hrafn_Top/U_Magnetometers/MF8, U_Hrafn_Top/U_Magnetometers/MF7, U_Hrafn_Top/U_Magnetometers/MF6, U_Hrafn_Top/U_Magnetometers/MF5, U_Hrafn_Top/U_Magnetometers/MF4, U_Hrafn_Top/U_Magnetometers/MF3, U_Hrafn_Top/U_Magnetometers/MF2, U_Hrafn_Top/U_Magnetometers/MF1. Parts and nets are listed once, with the designators drawn on the sheet.
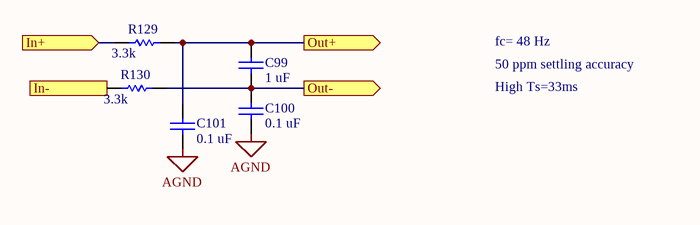
[diagram p4: Magnetometer_Filter.SchDoc]

### Parts
C99  1 uF  [CAPC1005X60X30NL05T10]
C100  0.1 uF  [CAPC0402(1005)60_L]
C101  0.1 uF  [CAPC0402(1005)60_L]
R129  Resistance: 3.3k  [RESC1005X40X25LL05T05]  (hidden comment: CRCW04023K30JNED)
R130  Resistance: 3.3k  [RESC1005X40X25LL05T05]  (hidden comment: CRCW04023K30JNED)

### Ports
In+ (in), In- (in), Out+ (out), Out- (out)

### Nets
AGND: C100.1 C101.1
In+: R129.1 ; port In+
In-: R130.1 ; port In-
Out+: C99.2 C101.2 R129.2 ; port Out+
Out-: C99.1 C100.2 R130.2 ; port Out-

### Channels
U_Hrafn_Top/U_Magnetometers/MF8: designators end in A; ports In+=2_T In-=AGND Out+=NetC99A_2 Out-=NetC99A_1
U_Hrafn_Top/U_Magnetometers/MF7: designators end in B; ports In+=2_C In-=2_H Out+=NetC99B_2 Out-=NetC99B_1
U_Hrafn_Top/U_Magnetometers/MF6: designators end in C; ports In+=2_B In-=2_H Out+=NetC99C_2 Out-=NetC99C_1
U_Hrafn_Top/U_Magnetometers/MF5: designators end in D; ports In+=2_A In-=2_H Out+=NetC99D_2 Out-=NetC99D_1
U_Hrafn_Top/U_Magnetometers/MF4: designators end in E; ports In+=1_T In-=AGND Out+=NetC99E_2 Out-=NetC99E_1
U_Hrafn_Top/U_Magnetometers/MF3: designators end in F; ports In+=1_C In-=1_H Out+=NetC99F_2 Out-=NetC99F_1
U_Hrafn_Top/U_Magnetometers/MF2: designators end in G; ports In+=1_B In-=1_H Out+=NetC99G_2 Out-=NetC99G_1
U_Hrafn_Top/U_Magnetometers/MF1: designators end in H; ports In+=1_A In-=1_H Out+=NetC99H_2 Out-=NetC99H_1

### Notes on the sheet
- fc= 48 Hz
- 50 ppm settling accuracy
- High Ts=33ms
- Title
- Size
- Date
- Tabloid
- Section
- Time
- Sheet
- of
- Revision
- Drawn
- 33-207 / 77 Mass. Ave.
- Cambridge, MA 02139
- File

### Library data of the parts
C99 = CMP-2008-02056-1: as C91 on sheet Magnetometers; Capacitance: 1 uF
C100 C101 = CMP-1034-02068-1: as C74 on sheet CAN_Bus; Technology: SMT; Value: 100nF; Max Thickness: 0.6 mm; Rated Voltage: 16 V
R129 R130 = CMP-2002-08581-1: Manufacturer: Vishay Dale; Part Number: CRCW04023K30JNED